# EAGLE design detachable-esp8266-4x-wire-to-board (EAGLE 9.1.3)
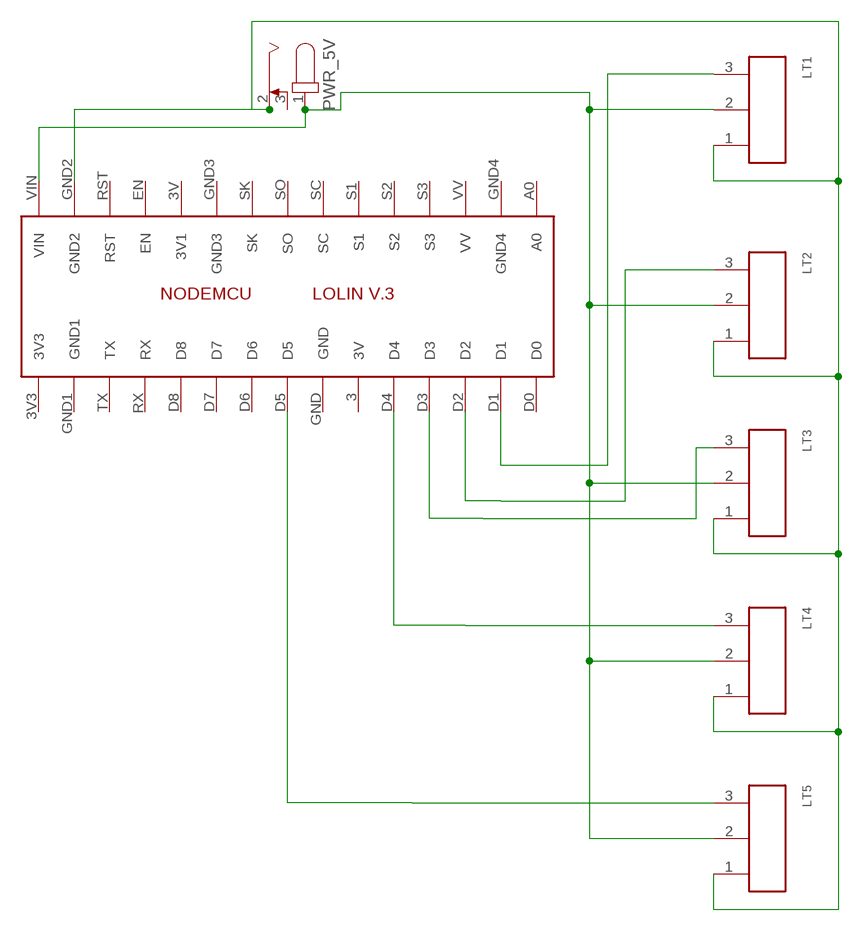
[diagram p0: schematic, sheet 1]

## Parts
IC1  LOLINV3SMALL  [LOLINV3_SMALL]
LT1  61900311121  [61900311121]
LT2  61900311121  [61900311121]
LT3  61900311121  [61900311121]
LT4  61900311121  [61900311121]
LT5  61900311121  [61900311121]
PWR_5V  694103303002  [69410X303002]

## Nets
5V: IC1.VIN LT1.2 LT2.2 LT3.2 LT4.2 LT5.2 PWR_5V.1
GND: IC1.GND2 LT1.1 LT2.1 LT3.1 LT4.1 LT5.1 PWR_5V.2
LT1: IC1.D1 LT1.3
LT2: IC1.D2 LT2.3
LT3: IC1.D3 LT3.3
LT4: IC1.D4 LT4.3
LT5: IC1.D5 LT5.3
Unconnected: IC1.3(3V) IC1.3V3 IC1.3V(3V1) IC1.A0 IC1.D0 IC1.D6 IC1.D7 IC1.D8 IC1.EN IC1.GND IC1.GND1 IC1.GND3 IC1.GND4 IC1.RST IC1.RX IC1.S1 IC1.S2 IC1.S3 IC1.SC IC1.SK IC1.SO IC1.TX IC1.VV PWR_5V.3

## Library data of the parts
IC1 = Lolin:LOLINV3
LT1-LT5 = Wurth_Elektronik_Electromechanic_Wire_to_Board_Connectors_rev19a:61900311121: WR-WTB 2.54mm Male Locking Header, 3 Pins=>Code : Con_WTB_2.54_PCB_THT_61900311121 <http://katalog.we-online.de/media/thumbs2/eican/thb_Con_WTB_2.54_PCB_THT_6190xx11121_pf2.jpg> Details see: http://katalog.we-online.de/en/em/WTB_2_54_MALE_LOCKING_HEADER_6190XX11121 Created 2014-06-05, Karrer Zheng 2014 (C) Würth Elektronik
PWR_5V = Wurth_Elektronik_Electromechanic_DC_Power_Jack_Connectors_rev18b:694103303002: WR-DC_DC Power Jack_Right Angled_THT Center Pin Ø1.3_Plug ID Ø1.35_Plug OD Ø3.5 ;=>Code : Con_WR-DC_THT_6941xx303002_694103303002 <http://katalog.we-online.de/media/images/v2/Family_WR-DC_THT_6941xx303002.jpg> Details see: http://katalog.we-online.de/em/datasheet/6941xx303002.pdf Created 2014-10-08, Karrer Zheng 2014 (C) Wurth Elektronik

## Board
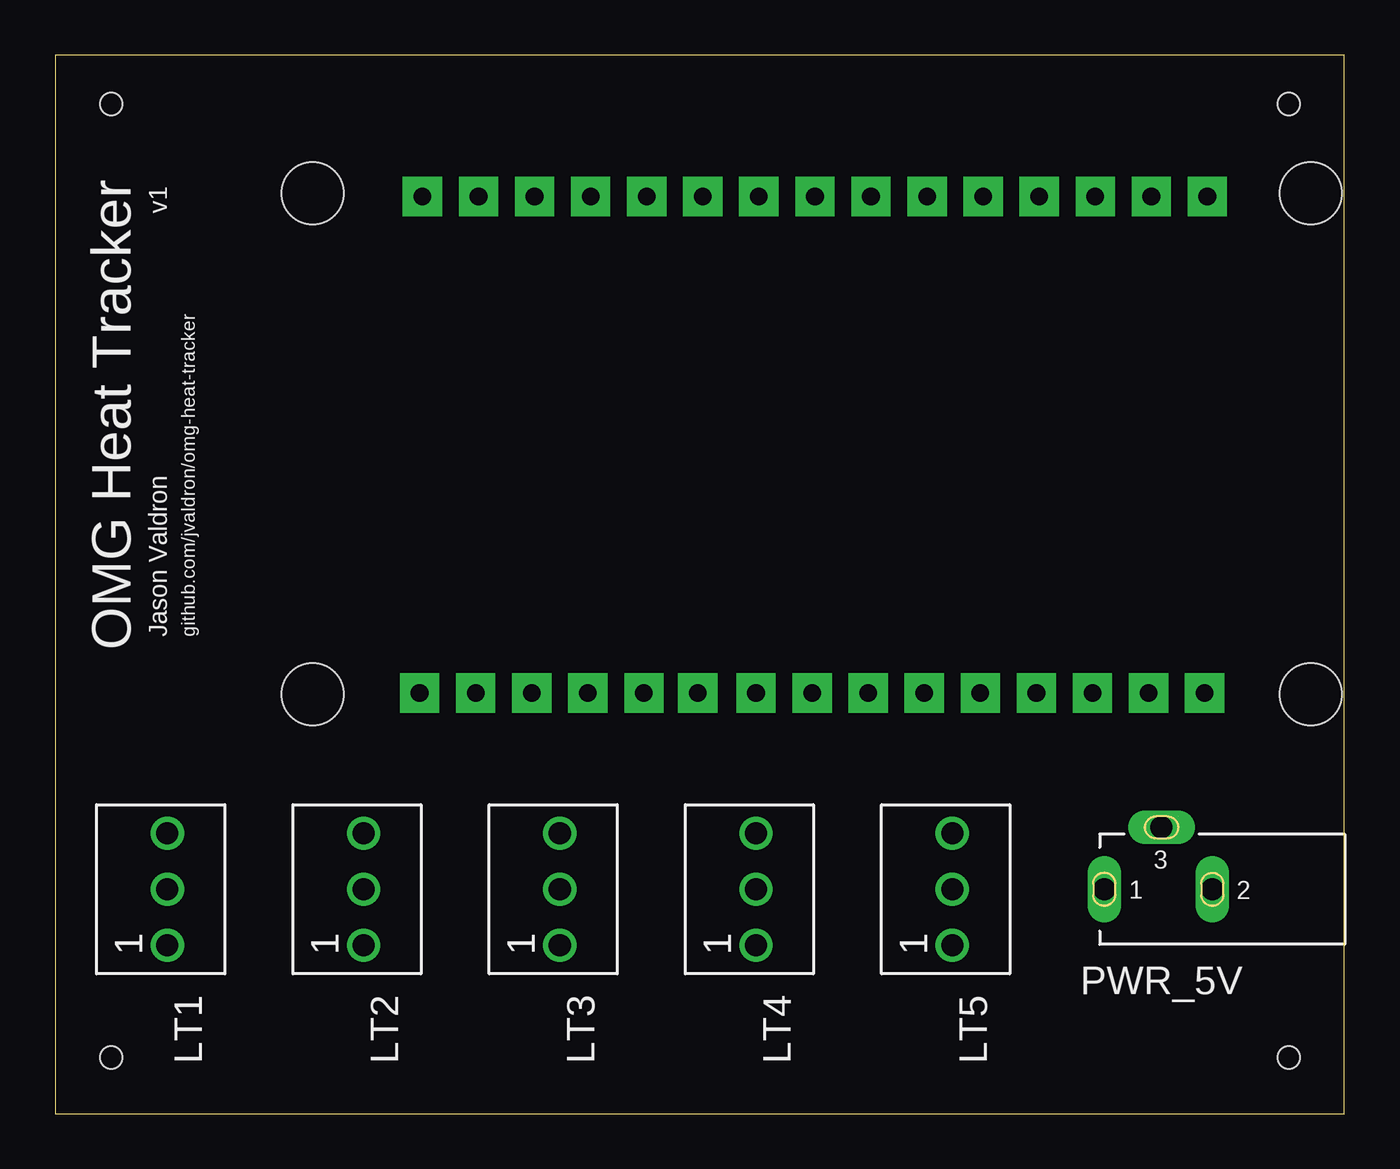
[diagram p1: board, top side]
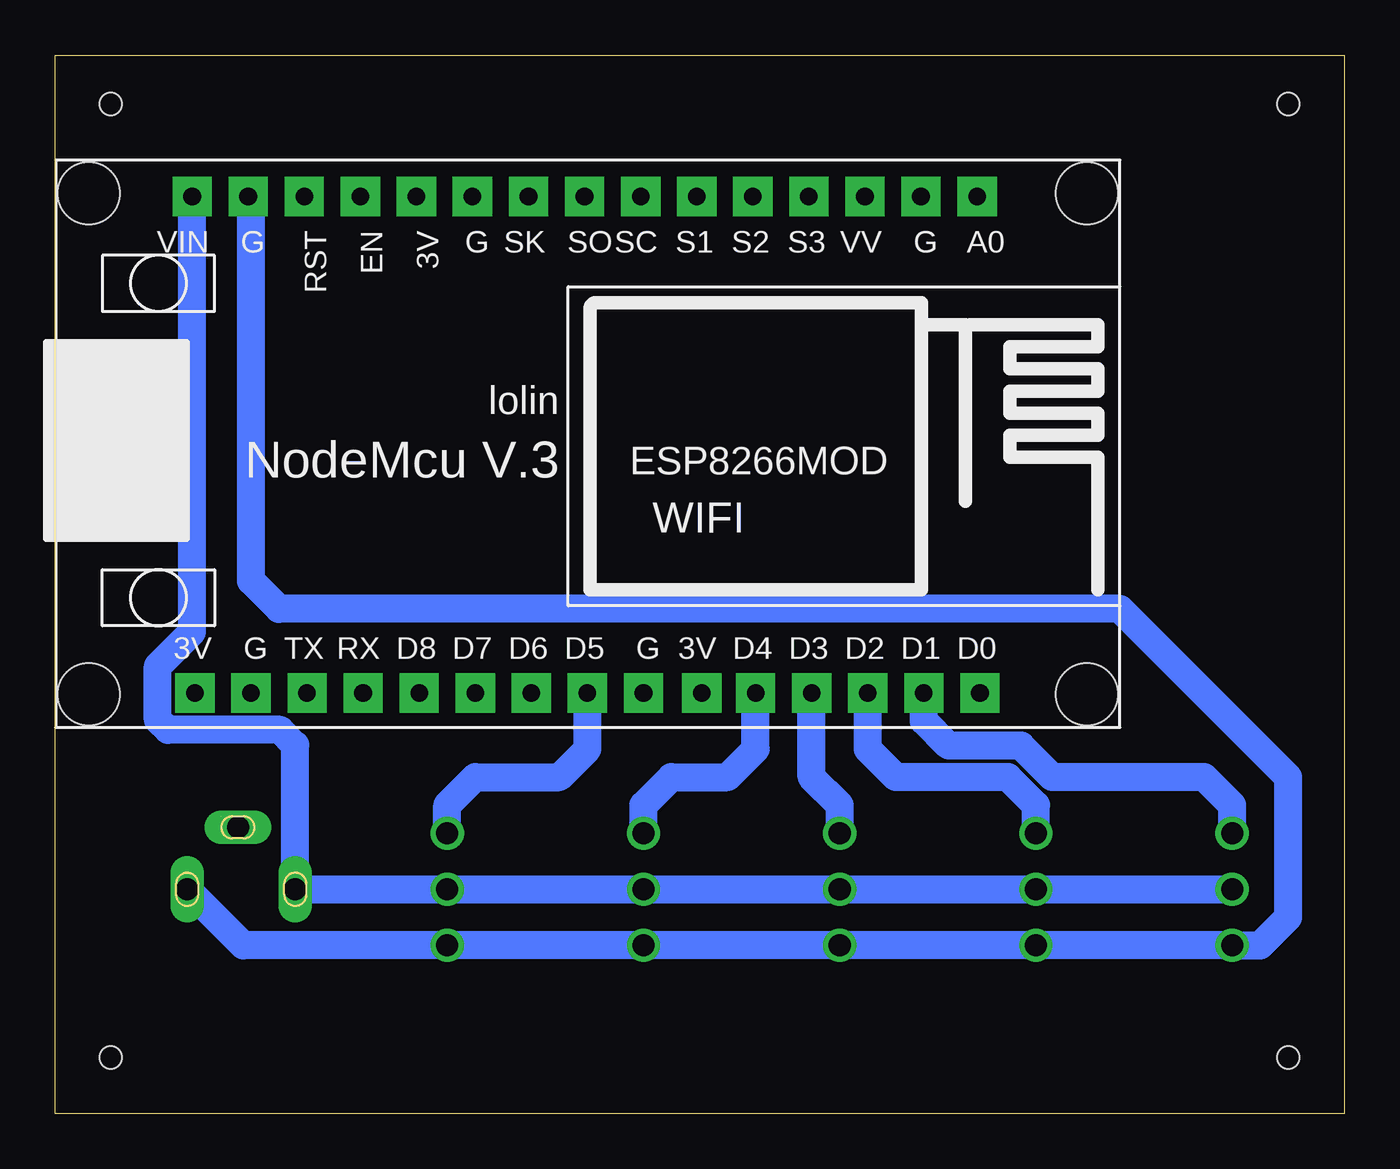
[diagram p2: board, bottom side, seen from below]

Size 58.4 x 47.93 mm. Coordinates in mm from the lower left corner, seen from the top.
Outline: 0,0 58.4,0 58.4,47.93 0,47.93 0,0
Copper layers (1*16): Top 0.035mm / dielectric 1.5mm / Bottom 0.035mm
Design rules "default": minimum track width 6mil, minimum drill 0.35mm, track to track 6mil, track to pad 6mil, pad to pad 6mil, via to via 6mil, smd to smd 6mil, copper to edge 40mil, drill to drill 6mil, minimum pad ring 10mil, minimum via ring 8mil, stop-mask expansion 4mil, vias tented up to drill 0mil, thermal gap 10mil
Holes 1 mm at 55.88,45.72 55.88,2.54 2.54,45.72 2.54,2.54

### Footprints (pad centres in the part's own frame; a part is rotated, then mirrored left to right if it is on the bottom)
LOLINV3_SMALL = drill 0.8 pad 1.778 square: 3 24.03,27.94; 3V 46.99,27.94; 3V3 36.957,5.461; A0 11.557,5.461; D0 11.43,27.94; D1 13.97,27.94; D2 16.51,27.94; D3 19.05,27.94; D4 21.59,27.94; D5 29.21,27.94; D6 31.75,27.94; D7 34.29,27.94; D8 36.83,27.94; EN 39.497,5.461; GND 26.67,27.94; GND1 44.45,27.94; GND2 44.577,5.461; GND3 34.417,5.461; GND4 14.097,5.461; RST 42.037,5.461; RX 39.37,27.94; S1 24.257,5.461; S2 21.717,5.461; S3 19.177,5.461; SC 26.797,5.461; SK 31.877,5.461; SO 29.337,5.461; TX 41.91,27.94; VIN 47.117,5.461; VV 16.637,5.461 | hole 2.8: 51.801,28; 51.801,5.31; 6.58,5.31; 6.58,28
61900311121 = drill 1: 1 2.54,0; 2 0,0; 3 -2.54,0
69410X303002 = drill 1 pad 1.5 long: 1 10.9,0; 2 6,0; 3 8.3,-2.8

### Placement (x,y rotation side)
IC1  5.08,46.99 180 bottom
LT1  5.08,10.16 270 top
LT2  13.97,10.16 270 top
LT3  22.86,10.16 270 top
LT4  31.75,10.16 270 top
LT5  40.64,10.16 270 top
PWR_5V  58.42,10.16 180 top

### Tracks (layer width: path | path; a pad name or v marks a point on that pad's centre or on a via)
5V
  Bottom 1.27: IC1.VIN 52.2,21.82 53.75,20.27 53.75,17.84 53.28,17.37 48.21,17.37 47.52,16.69 PWR_5V.1 LT5.2 LT4.2 LT3.2 LT2.2 LT1.2
GND
  Bottom 1.27: PWR_5V.2 49.88,7.62 LT5.1 LT4.1 LT3.1 LT2.1 LT1.1 3.81,7.62 2.54,8.89 2.54,15.24 10.16,22.86 48.26,22.86 49.53,24.13 49.53,41.4 IC1.GND2
LT1
  Bottom 1.27: LT1.3 5.08,13.97 6.35,15.24 13.23,15.24 14.65,16.66 17.93,16.66 19.05,17.78 IC1.D1
LT2
  Bottom 1.27: LT2.3 13.97,13.97 15.24,15.24 20.32,15.24 21.59,16.51 IC1.D2
LT3
  Bottom 1.27: LT3.3 22.86,13.97 24.13,15.24 IC1.D3
LT4
  Bottom 1.27: LT4.3 31.75,13.97 30.48,15.24 27.94,15.24 26.67,16.51 IC1.D4
LT5
  Bottom 1.27: LT5.3 40.64,13.97 39.37,15.24 35.56,15.24 34.29,16.51 IC1.D5

### Text on the board
tNames: OMG Heat Tracker | v1 | Jason Valdron | github.com/jvaldron/omg-heat-tracker